# EAGLE design picox_1.1 (EAGLE 6.5.0)
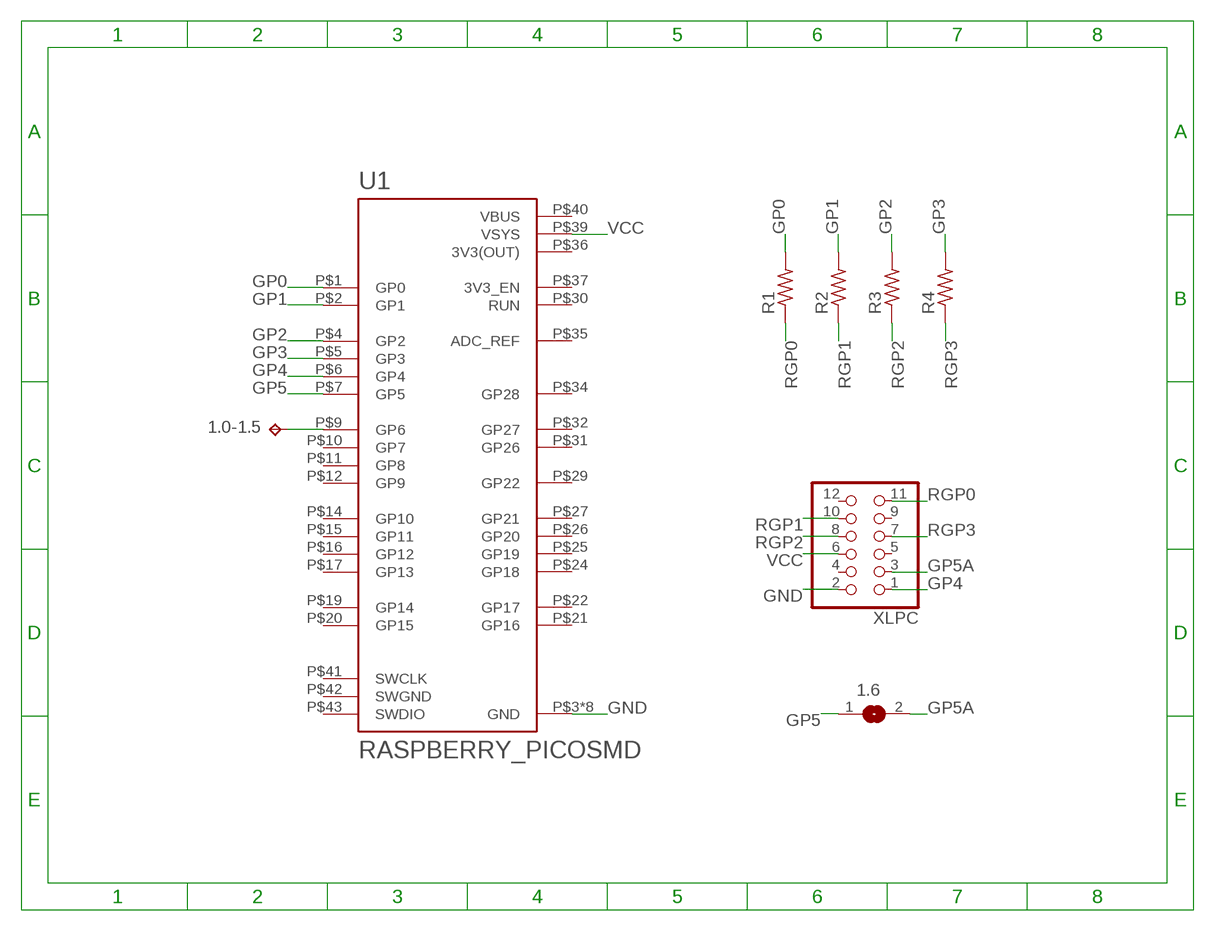
[diagram p0: schematic, sheet 1]

## Parts
1.0-1.5  TPTP16SQ  [TP16SQ]
1.6  SJ  [SJ]
R1  R-US_R0805  [R0805]
R2  R-US_R0805  [R0805]
R3  R-US_R0805  [R0805]
R4  R-US_R0805  [R0805]
U1  RASPBERRY_PICOSMD  [PICO-PKG-SMD]
XLPC  PINHD-2X6  [2X06]

## Nets
D0: 1.0-1.5.TP U1.P$9(GP6)
GND: U1.P$3(GND) U1.P$8(GND) U1.P$13(GND) U1.P$18(GND) U1.P$23(GND) U1.P$28(GND) U1.P$33(GND) U1.P$38(GND) XLPC.2
GP0: R1.2 U1.P$1(GP0)
GP1: R2.2 U1.P$2(GP1)
GP2: R3.2 U1.P$4(GP2)
GP3: R4.2 U1.P$5(GP3)
GP4: U1.P$6(GP4) XLPC.1
GP5: 1.6.1 U1.P$7(GP5)
GP5A: 1.6.2 XLPC.3
RGP0: R1.1 XLPC.11
RGP1: R2.1 XLPC.10
RGP2: R3.1 XLPC.8
RGP3: R4.1 XLPC.7
VCC: U1.P$39(VSYS) XLPC.6
Unconnected: U1.P$10(GP7) U1.P$11(GP8) U1.P$12(GP9) U1.P$14(GP10) U1.P$15(GP11) U1.P$16(GP12) U1.P$17(GP13) U1.P$19(GP14) U1.P$20(GP15) U1.P$21(GP16) U1.P$22(GP17) U1.P$24(GP18) U1.P$25(GP19) U1.P$26(GP20) U1.P$27(GP21) U1.P$29(GP22) U1.P$30(RUN) U1.P$31(GP26) U1.P$32(GP27) U1.P$34(GP28) U1.P$35(ADC_REF) U1.P$37(3V3_EN) U1.P$41(SWCLK) U1.P$43(SWDIO) XLPC.4 XLPC.5 XLPC.9 XLPC.12

## Power pins joined to a net without a drawn wire
3V3(OUT): U1.P$36(3V3(OUT))
SWGND: U1.P$42(SWGND)
VBUS: U1.P$40(VBUS)

## Library data of the parts
1.0-1.5 = testpad:TP: Test pad
1.6 = jumper:SJ: SMD solder JUMPER
R1-R4 = rcl:R-US_: RESISTOR, American symbol
U1 = RpiPico:RASPBERRY_PICO: Raspberry Pi Pico
XLPC = pinhead:PINHD-2X6: PIN HEADER

## Board
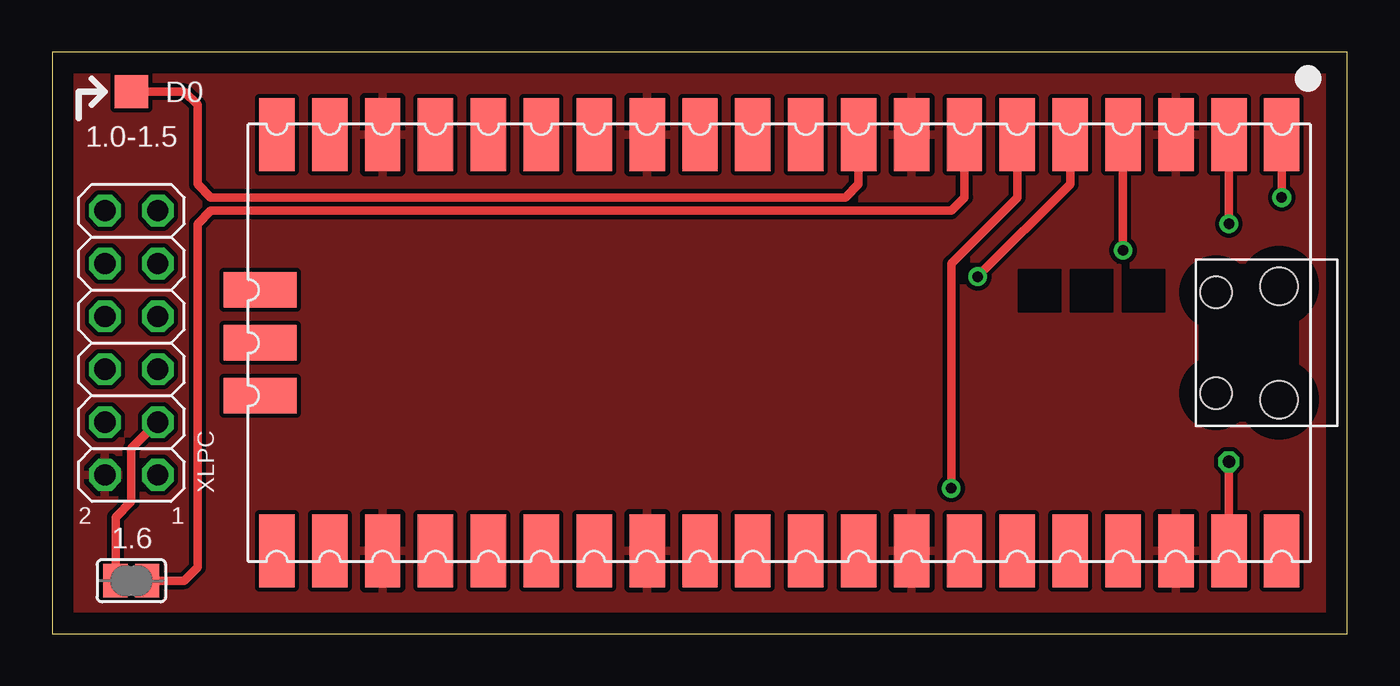
[diagram p1: board, top side]
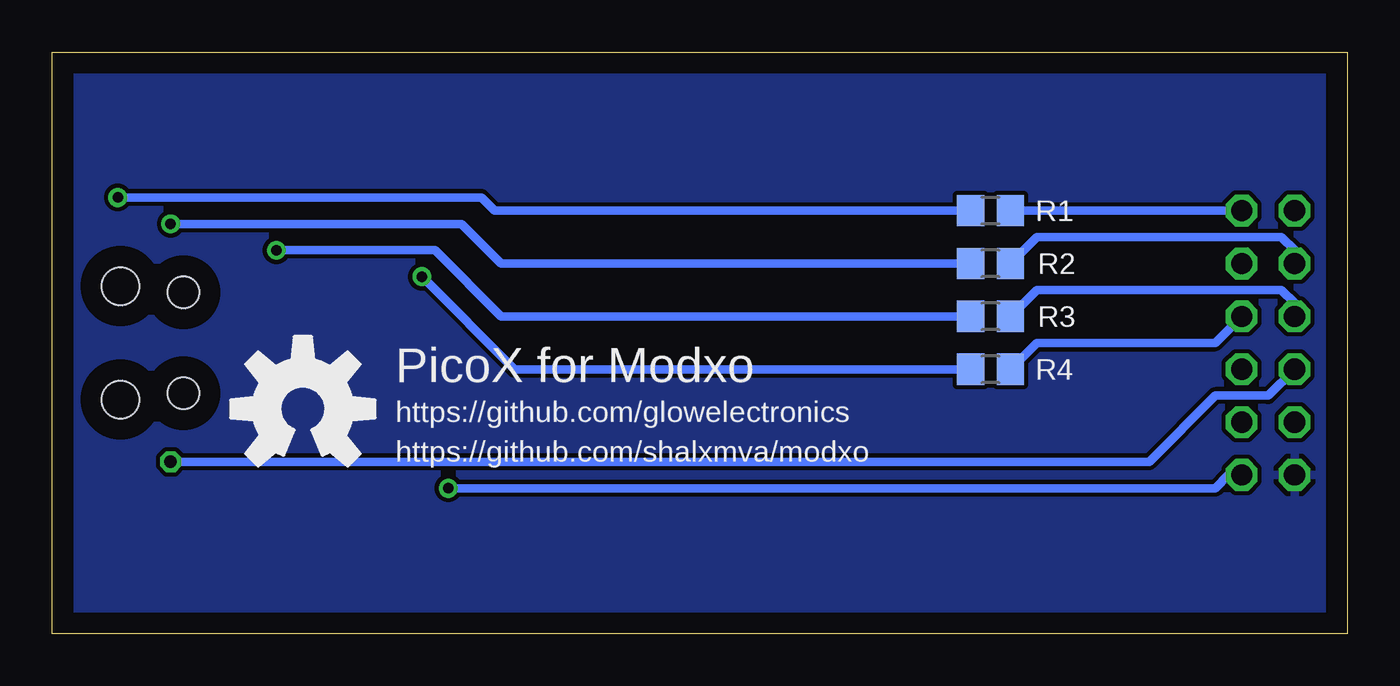
[diagram p2: board, bottom side, seen from below]

Size 62.21 x 27.94 mm. Coordinates in mm from the lower left corner, seen from the top.
Outline: 0,0 62.21,0 62.21,27.94 0,27.94 0,0
Copper layers (1*16): Top 0.035mm / dielectric 1.5mm / Bottom 0.035mm
Design rules "default": minimum track width 10mil, minimum drill 24mil, track to track 8mil, track to pad 8mil, pad to pad 8mil, via to via 8mil, smd to smd 8mil, copper to edge 40mil, drill to drill 8mil, minimum pad ring 10mil, minimum via ring 8mil, stop-mask expansion 4mil, vias tented up to drill 0mil, thermal gap 10mil

### Footprints (pad centres in the part's own frame; a part is rotated, then mirrored left to right if it is on the bottom)
TP16SQ = smd 1.6 x 1.6: TP 0,0
SJ = smd 1.168 x 1.6: 1 -0.762,0; 2 0.762,0
R0805 = smd 1.3 x 1.5: 1 -0.95,0; 2 0.95,0
PICO-PKG-SMD = smd 3.5 x 1.7: P$1 -10,24.13; P$2 -10,21.59; P$3 -10,19.05; P$4 -10,16.51; P$5 -10,13.97; P$6 -10,11.43; P$7 -10,8.89; P$8 -10,6.35; P$9 -10,3.81; P$10 -10,1.27; P$11 -10,-1.27; P$12 -10,-3.81; P$13 -10,-6.35; P$14 -10,-8.89; P$15 -10,-11.43; P$16 -10,-13.97; P$17 -10,-16.51; P$18 -10,-19.05; P$19 -10,-21.59; P$20 -10,-24.13; P$21 10,-24.13; P$22 10,-21.59; P$23 10,-19.05; P$24 10,-16.51; P$25 10,-13.97; P$26 10,-11.43; P$27 10,-8.89; P$28 10,-6.35; P$29 10,-3.81; P$30 10,-1.27; P$31 10,1.27; P$32 10,3.81; P$33 10,6.35; P$34 10,8.89; P$35 10,11.43; P$36 10,13.97; P$37 10,16.51; P$38 10,19.05; P$39 10,21.59; P$40 10,24.13 | smd 1.7 x 3.5: P$41 -2.54,-24.925; P$42 0,-24.925; P$43 2.54,-24.925 | hole 1.8: -2.725,24; 2.725,24 | hole 1.5: -2.425,20.97; 2.425,20.97
2X06 = drill 1.016 octagon: 1 -6.35,-1.27; 2 -6.35,1.27; 3 -3.81,-1.27; 4 -3.81,1.27; 5 -1.27,-1.27; 6 -1.27,1.27; 7 1.27,-1.27; 8 1.27,1.27; 9 3.81,-1.27; 10 3.81,1.27; 11 6.35,-1.27; 12 6.35,1.27

### Placement (x,y rotation side)
1.0-1.5  3.81,26.04 0 top
1.6  3.81,2.54 180 top
R1  17.14,20.32 180 bottom
R2  17.14,17.78 180 bottom
R3  17.14,15.24 180 bottom
R4  17.14,12.7 180 bottom
U1  34.92,13.97 270 top
U$5  [OSHW-LOGO-L]  50.16,10.79 0 bottom
XLPC  3.81,13.97 90 top

### Tracks (layer width: path | path; a pad name or v marks a point on that pad's centre or on a via)
D0
  Top 0.406: U1.P$9 38.73,21.59 38.1,20.95 7.62,20.95 6.99,21.59 6.99,25.4 6.35,26.04 1.0-1.5.TP
GND
  pour Bottom: 0,0 0,27.94 62.23,27.94 62.23,0
  pour Top: 0,0 0,27.94 62.23,27.94 62.23,0
GP0  (via drill 0.5)
  Top 0.406: v59.05,20.95 U1.P$1
  Bottom 0.406: v59.05,20.95 41.59,20.95 40.95,20.32 R1.2
GP1  (via drill 0.5)
  Top 0.406: v56.52,19.68 U1.P$2
  Bottom 0.406: v56.52,19.68 42.55,19.68 40.64,17.78 R2.2
GP2  (via drill 0.5)
  Top 0.406: v51.44,18.41 U1.P$4
  Bottom 0.406: v51.44,18.41 43.81,18.41 40.64,15.24 R3.2
GP3  (via drill 0.5)
  Top 0.406: v44.45,17.14 48.9,21.59 U1.P$5
  Bottom 0.406: R4.2 40.01,12.7 v44.45,17.14
GP4  (via drill 0.5)
  Top 0.406: v43.18,6.99 43.18,17.78 46.35,20.95 U1.P$6
  Bottom 0.406: v43.18,6.99 6.35,6.99 5.71,7.62 XLPC.1
GP5
  Top 0.406: U1.P$7 43.81,20.95 43.18,20.32 7.62,20.32 6.99,19.68 6.99,3.17 6.35,2.54 1.6.1
GP5A
  Top 0.406: 1.6.2 3.05,5.59 3.81,6.35 3.81,8.89 XLPC.3
RGP0
  Bottom 0.406: R1.1 XLPC.11
RGP1
  Bottom 0.406: R2.1 14.93,19.05 3.17,19.05 2.54,18.41 XLPC.10
RGP2
  Bottom 0.406: R3.1 14.93,16.51 3.17,16.51 2.54,15.88 XLPC.8
RGP3
  Bottom 0.406: R4.1 14.93,13.97 6.35,13.97 XLPC.7
VCC  (via drill 0.6)
  Top 0.406: v56.52,8.26 U1.P$39
  Bottom 0.406: v56.52,8.26 9.53,8.26 6.35,11.43 3.81,11.43 XLPC.6

### Text on the board
tNames: D0 | 2 | 1
bNames: PicoX for Modxo | https://github.com/glowelectronics | https://github.com/shalxmva/modxo